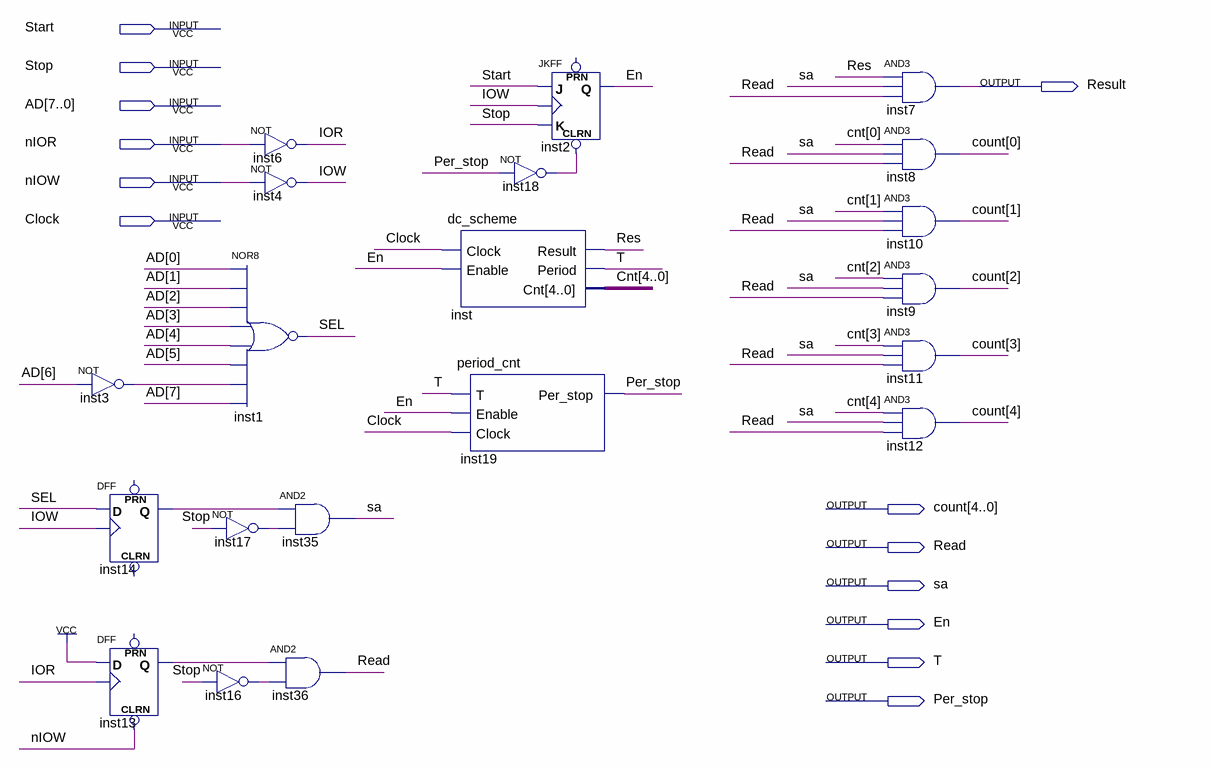
[diagram p0: schematic sheet]
// Quartus schematic interface.bdf as structural Verilog: 20 symbols, 13 pins
module \interface  (
  input  Start,
  input  Stop,
  input  [7:0] AD,
  input  nIOR,
  input  nIOW,
  input  Clock,
  output Result,
  output [4:0] count,
  output Read,
  output sa,
  output En,
  output T,
  output Per_stop
);

  wire inst3_out, inst13_q, inst14_q, inst16_out, inst17_out, inst18_out, IOR, IOW, Res, SEL;
  wire [4:0] cnt;

  not inst3 (inst3_out, AD[6]);
  DFF inst14 (.CLK(IOW), .D(SEL), .Q(inst14_q));  // open: CLRN, PRN
  DFF inst13 (.CLRN(nIOW), .CLK(IOR), .D(1'b1), .Q(inst13_q));  // open: PRN
  not inst6 (IOR, nIOR);
  not inst4 (IOW, nIOW);
  nor inst1 (SEL, AD[0], AD[1], AD[2], AD[3], AD[4], AD[5], inst3_out, AD[7]);
  not inst17 (inst17_out, Stop);
  not inst16 (inst16_out, Stop);
  and inst35 (sa, inst14_q, inst17_out);
  and inst36 (Read, inst13_q, inst16_out);
  dc_scheme inst (.Clock(Clock), .Enable(En), .Result(Res), .Period(T), .Cnt(cnt));
  period_cnt inst19 (.T(T), .Enable(En), .Clock(Clock), .Per_stop(Per_stop));
  JKFF inst2 (.CLRN(inst18_out), .K(Stop), .J(Start), .CLK(IOW), .Q(En));  // open: PRN
  not inst18 (inst18_out, Per_stop);
  and inst7 (Result, Res, sa, Read);
  and inst8 (count[0], cnt[0], sa, Read);
  and inst10 (count[1], cnt[1], sa, Read);
  and inst9 (count[2], cnt[2], sa, Read);
  and inst11 (count[3], cnt[3], sa, Read);
  and inst12 (count[4], cnt[4], sa, Read);
endmodule
